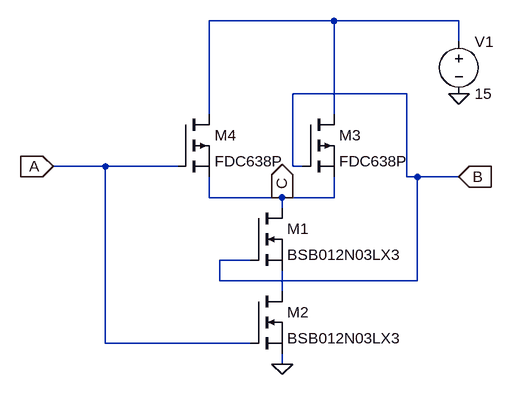
[diagram p0: schematic Draft4.asc]
Draft4.asc, the LTspice schematic file:
Version 4
SHEET 1 880 680
WIRE 256 -144 64 -144
WIRE 448 -144 256 -144
WIRE 448 -112 448 -144
WIRE 368 -32 192 -32
WIRE 64 0 64 -144
WIRE 256 0 256 -144
WIRE -96 80 -176 80
WIRE 16 80 -96 80
WIRE 192 80 192 -32
WIRE 208 80 192 80
WIRE 368 96 368 -32
WIRE 384 96 368 96
WIRE 448 96 384 96
WIRE 64 128 64 96
WIRE 176 128 64 128
WIRE 256 128 256 96
WIRE 256 128 176 128
WIRE 176 144 176 128
WIRE 128 224 80 224
WIRE 80 256 80 224
WIRE 384 256 384 96
WIRE 384 256 80 256
WIRE 176 272 176 240
WIRE -96 352 -96 80
WIRE 128 352 -96 352
WIRE 176 384 176 368
FLAG 448 -32 0
FLAG 176 384 0
FLAG -176 80 A
IOPIN -176 80 In
FLAG 176 128 C
IOPIN 176 128 Out
FLAG 448 96 B
IOPIN 448 96 In
SYMBOL nmos 128 144 R0
SYMATTR InstName M1
SYMATTR Value BSB012N03LX3
SYMBOL nmos 128 272 R0
SYMATTR InstName M2
SYMATTR Value BSB012N03LX3
SYMBOL pmos 208 0 R0
SYMATTR InstName M3
SYMATTR Value FDC638P
SYMBOL pmos 16 0 R0
SYMATTR InstName M4
SYMATTR Value FDC638P
SYMBOL voltage 448 -128 R0
SYMATTR InstName V1
SYMATTR Value 15

The netlist it stands for:
* Draft4.asc
M1 C B N002 N002 BSB012N03LX3
M2 N002 A 0 0 BSB012N03LX3
M3 N001 B C C FDC638P
M4 N001 A C C FDC638P
V1 N001 0 15
.model NMOS NMOS
.model PMOS PMOS
.lib standard.mos
.backanno
.end